# EAGLE design Sensor_Cheeta (EAGLE 9.6.2)
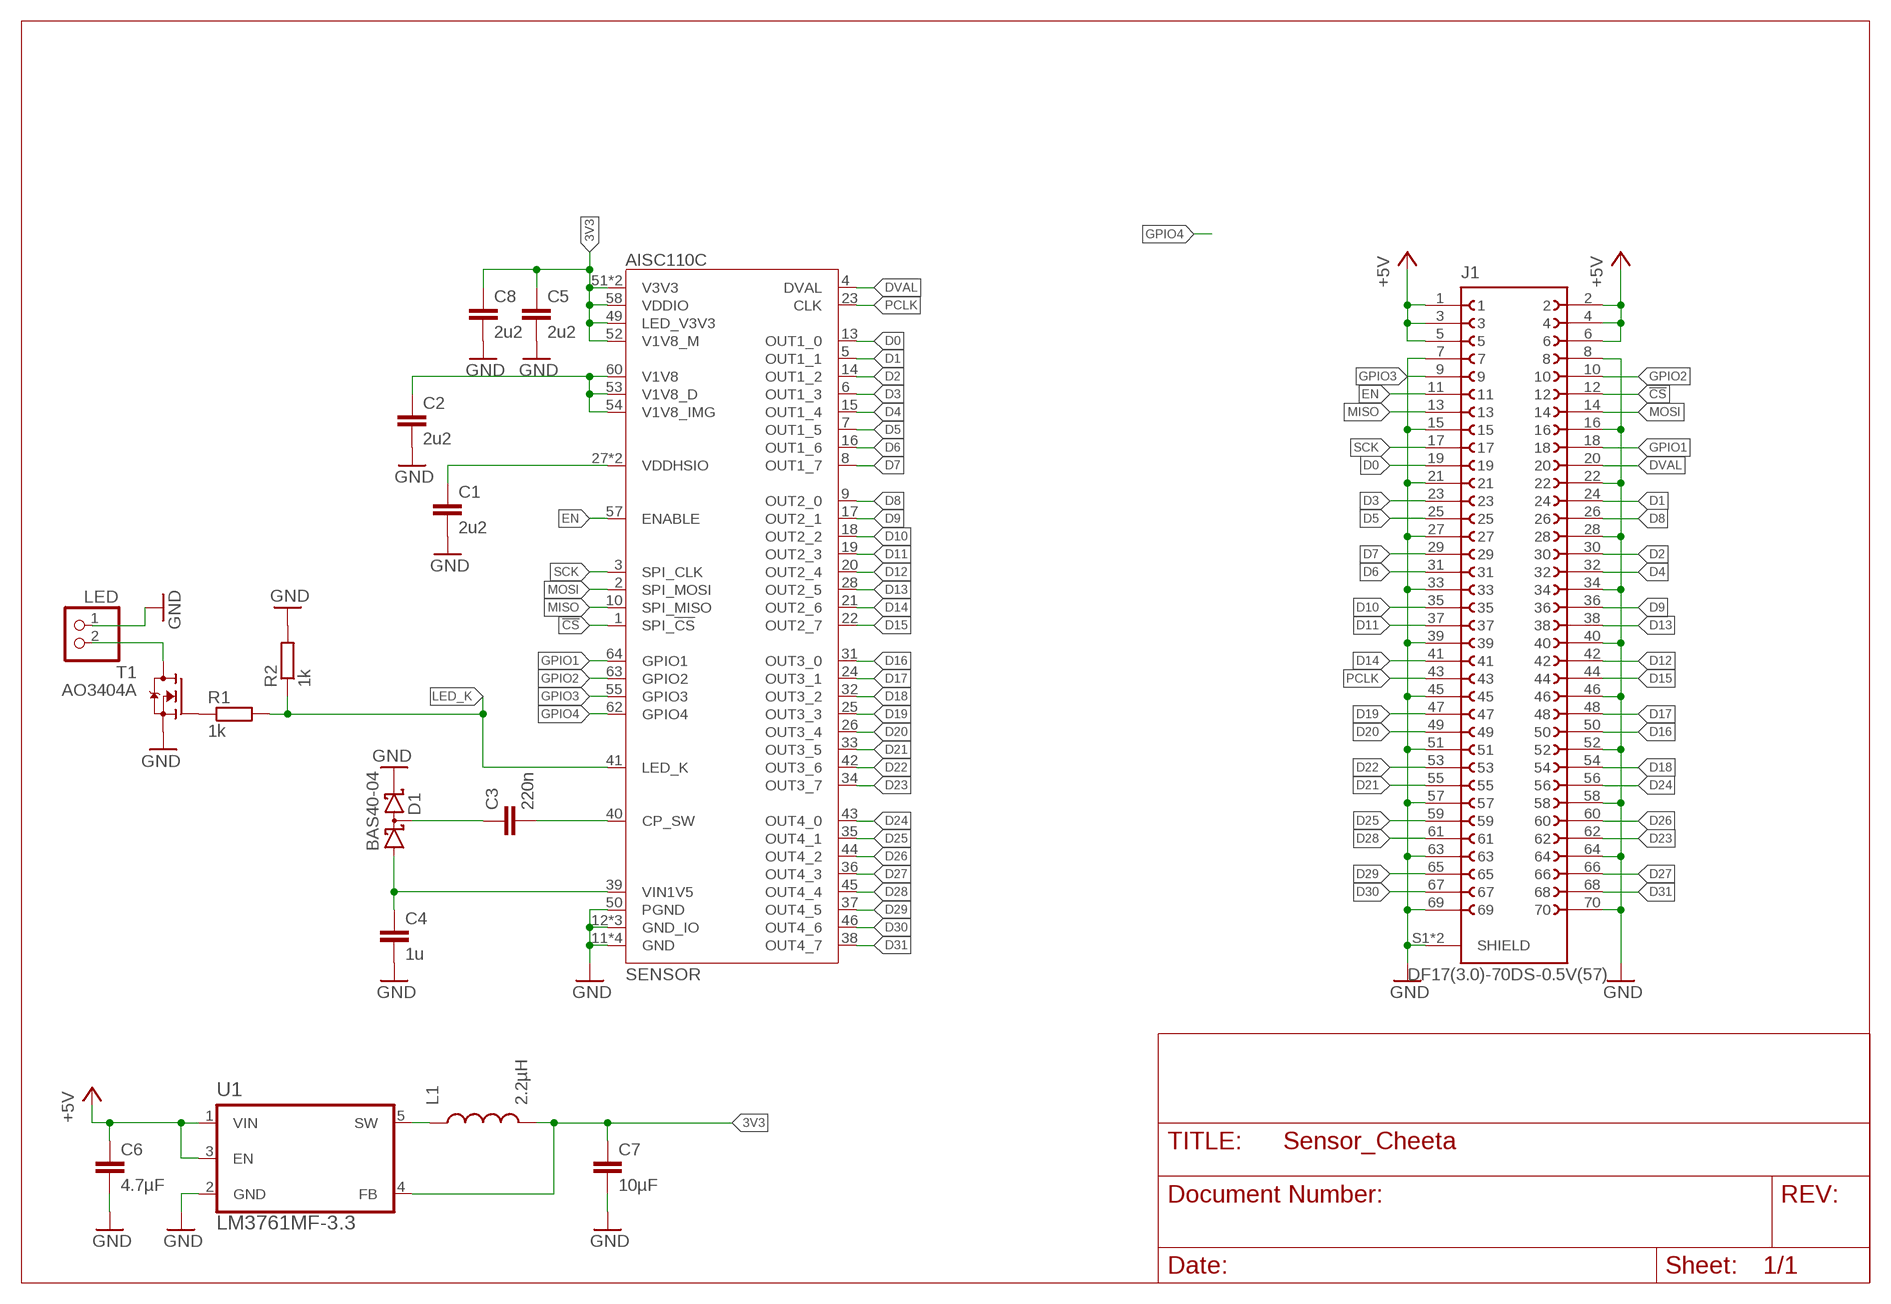
[diagram p0: schematic, sheet 1]

## Parts
C1  2u2  C-EUC0603  [C0603]
C2  2u2  C-EUC0603  [C0603]
C3  220n  C-EUC0603  [C0603]
C4  1u  C-EUC0603  [C0603]
C5  2u2  C-EUC0603  [C0603]
C6  4.7µF  C-EUC0603  [C0603]
C7  10µF  C-EUC0603  [C0603]
C8  2u2  C-EUC0603  [C0603]
D1  BAS40-04  [SOT23]
J1  DF17(3.0)-70DS-0.5V(57)  [DF17(3.0)-70DS-0.5V(57)]
L1  2.2µH  DO3314  [SO3314]
LED  PINHD-1X2  [1X02]
R1  1k  R-EU_R0603  [R0603]
R2  1k  R-EU_R0603  [R0603]
SENSOR  AISC110C  [64_LD_OLGA]
T1  AO3404A  N-MOSFET-SOT23-3  [SOT23]
U1  LM3761MF-3.3  LM3671  [SOT95P284X122-5N]

## Nets
3V3: C5.1 C7.1 C8.1 L1.2 SENSOR.49(LED_V3V3) SENSOR.51(V3V3) SENSOR.52(V1V8_M) SENSOR.58(VDDIO) SENSOR.59(V3V3) U1.4(FB)
!CS: J1.12 SENSOR.1(SPI_!CS)
+5V: C6.1 J1.1 J1.2 J1.3 J1.4 J1.5 J1.6 U1.1(VIN) U1.3(EN)
D0: J1.19 SENSOR.13(OUT1_0)
D1: J1.24 SENSOR.5(OUT1_1)
D2: J1.30 SENSOR.14(OUT1_2)
D3: J1.23 SENSOR.6(OUT1_3)
D4: J1.32 SENSOR.15(OUT1_4)
D5: J1.25 SENSOR.7(OUT1_5)
D6: J1.31 SENSOR.16(OUT1_6)
D7: J1.29 SENSOR.8(OUT1_7)
D8: J1.26 SENSOR.9(OUT2_0)
D9: J1.36 SENSOR.17(OUT2_1)
D10: J1.35 SENSOR.18(OUT2_2)
D11: J1.37 SENSOR.19(OUT2_3)
D12: J1.42 SENSOR.20(OUT2_4)
D13: J1.38 SENSOR.28(OUT2_5)
D14: J1.41 SENSOR.21(OUT2_6)
D15: J1.44 SENSOR.22(OUT2_7)
D16: J1.50 SENSOR.31(OUT3_0)
D17: J1.48 SENSOR.24(OUT3_1)
D18: J1.54 SENSOR.32(OUT3_2)
D19: J1.47 SENSOR.25(OUT3_3)
D20: J1.49 SENSOR.26(OUT3_4)
D21: J1.55 SENSOR.33(OUT3_5)
D22: J1.53 SENSOR.42(OUT3_6)
D23: J1.62 SENSOR.34(OUT3_7)
D24: J1.56 SENSOR.43(OUT4_0)
D25: J1.59 SENSOR.35(OUT4_1)
D26: J1.60 SENSOR.44(OUT4_2)
D27: J1.66 SENSOR.36(OUT4_3)
D28: J1.61 SENSOR.45(OUT4_4)
D29: J1.65 SENSOR.37(OUT4_5)
D30: J1.67 SENSOR.46(OUT4_6)
D31: J1.68 SENSOR.38(OUT4_7)
DVAL: J1.20 SENSOR.4(DVAL)
EN: J1.11 SENSOR.57(ENABLE)
GND: C1.2 C2.2 C4.2 C5.2 C6.2 C7.2 C8.2 D1.2(C2) J1.7 J1.8 J1.15 J1.16 J1.21 J1.22 J1.27 J1.28 J1.33 J1.34 J1.39 J1.40 J1.45 J1.46 J1.51 J1.52 J1.57 J1.58 J1.63 J1.64 J1.69 J1.70 J1.S1(SHIELD) J1.S2(SHIELD) LED.1 R2.2 SENSOR.11(GND) SENSOR.12(GND_IO) SENSOR.30(GND_IO) SENSOR.47(GND_IO) SENSOR.48(GND) SENSOR.50(PGND) SENSOR.56(GND) SENSOR.61(GND) T1.2(S) U1.2(GND)
GPIO1: J1.18 SENSOR.64(GPIO1)
GPIO2: J1.10 SENSOR.63(GPIO2)
GPIO3: J1.9 SENSOR.55(GPIO3)
GPIO4: SENSOR.62(GPIO4)
LED_K: R1.2 R2.1 SENSOR.41(LED_K)
MISO: J1.13 SENSOR.10(SPI_MISO)
MOSI: J1.14 SENSOR.2(SPI_MOSI)
N$00003: C3.2 SENSOR.40(CP_SW)
N$00004: C4.1 D1.1(A1) SENSOR.39(VIN1V5)
N$00005: C3.1 D1.3(C1A2)
N$00006: LED.2 T1.3(D)
N$00009: L1.1 U1.5(SW)
N$00011: C2.1 SENSOR.53(V1V8_D) SENSOR.54(V1V8_IMG) SENSOR.60(V1V8)
N$00013: C1.1 SENSOR.27(VDDHSIO) SENSOR.29(VDDHSIO)
N$29: R1.1 T1.1(G)
PCLK: J1.43 SENSOR.23(CLK)
SCK: J1.17 SENSOR.3(SPI_CLK)

## Library data of the parts
C1 C2 C4 C5 C8 = rcl:C-EU: CAPACITOR, European symbol; BUERKLIN: 53D1659; LAGERORT: 20/10; MBM: 10; PREIS: 0,10; SPICEPREFIX: C
C3 = rcl:C-EU: CAPACITOR, European symbol; BUERKLIN: 53D2071; MBM: 10; PREIS: 0,10; SPICEPREFIX: C
C6 = rcl:C-EU: CAPACITOR, European symbol; BUERKLIN: 53D1659; LAGERORT: 20/10; MBM: 10; PREIS: 0,10
C7 = rcl:C-EU: CAPACITOR, European symbol; BUERKLIN: 53D2088; MBM: 10; PREIS: 0,29
D1 = diode:BAS40-04: Silicon Schottky Diodes General-purpose diode for high-speed switching
J1 = Hirose:DF17(3.0)-70DS-0.5V(57)
L1 = inductor-coilcraft:DO3314: DO3314; FARNELL: 2457514; LAGERORT: 102/06; MBM: 1; PREIS: 1,70
LED = pinhead:PINHD-1X2: PIN HEADER
R1 R2 = rcl:R-EU_: RESISTOR, European symbol; LCSC: C11702; SPICEPREFIX: R
SENSOR = aistorm:AISC110C: AISC110C 80x120 Pixel Ultra High-Speed Imager
T1 = transistor-fet:N-MOSFET: N-MOSFET; LCSC: C30010
U1 = texas:LM3671: LM3671 2-MHz, 600-mA Step-Down DC-DC Converter Farnell Order Numbers: MF-3.3 : 1685767 MF-2.5 : 2492196 MF-1.8 : 1685654 MF-1.5 : 2492195 MF-ADJ: 1008256

## Board
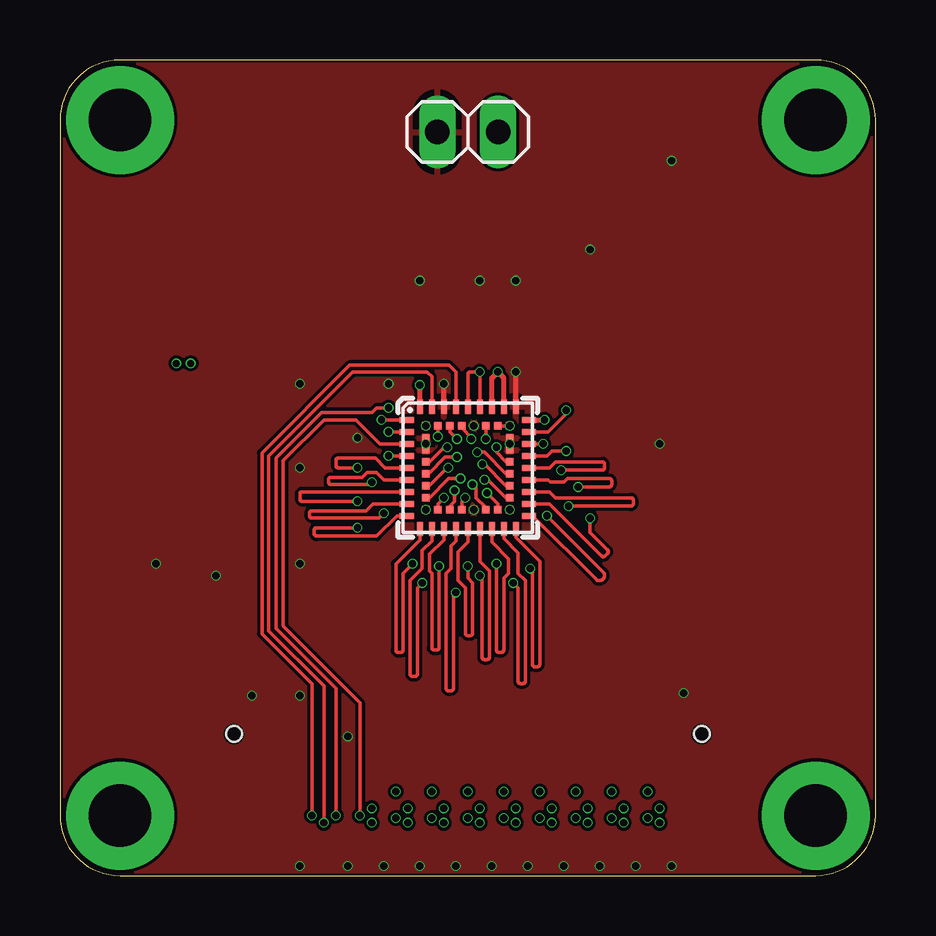
[diagram p1: board, top side]
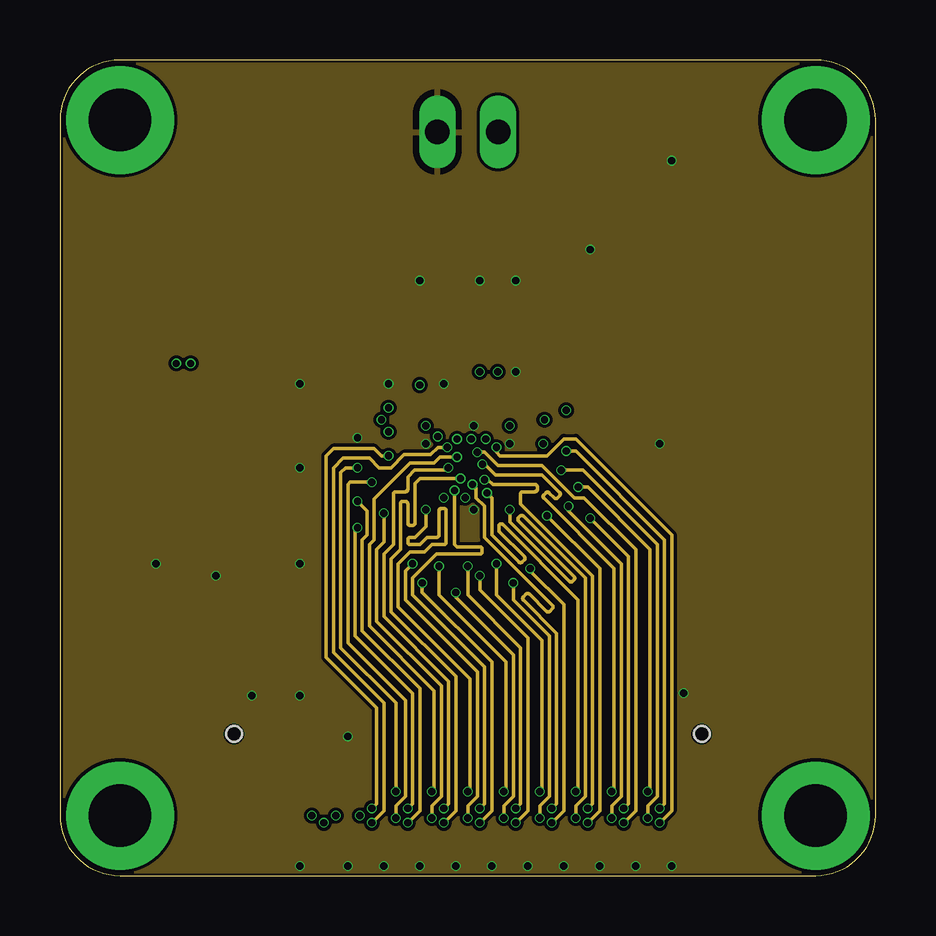
[diagram p2: board, inner layer Route2]
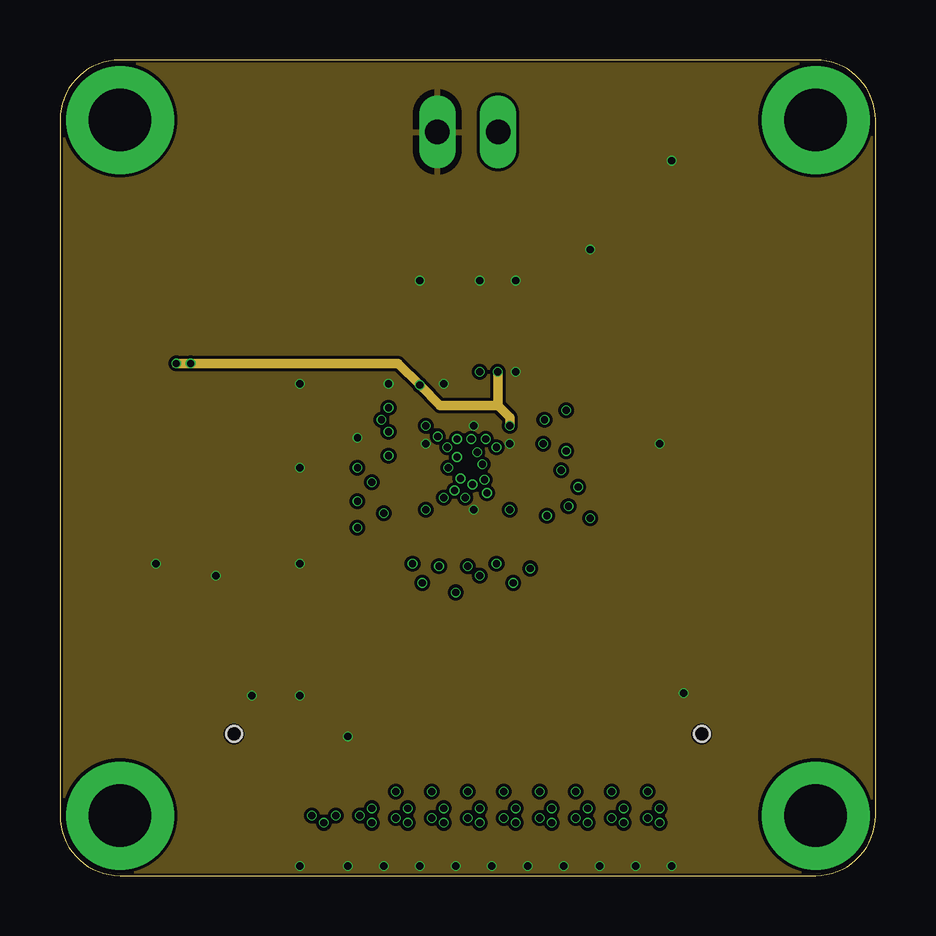
[diagram p3: board, inner layer Route15]
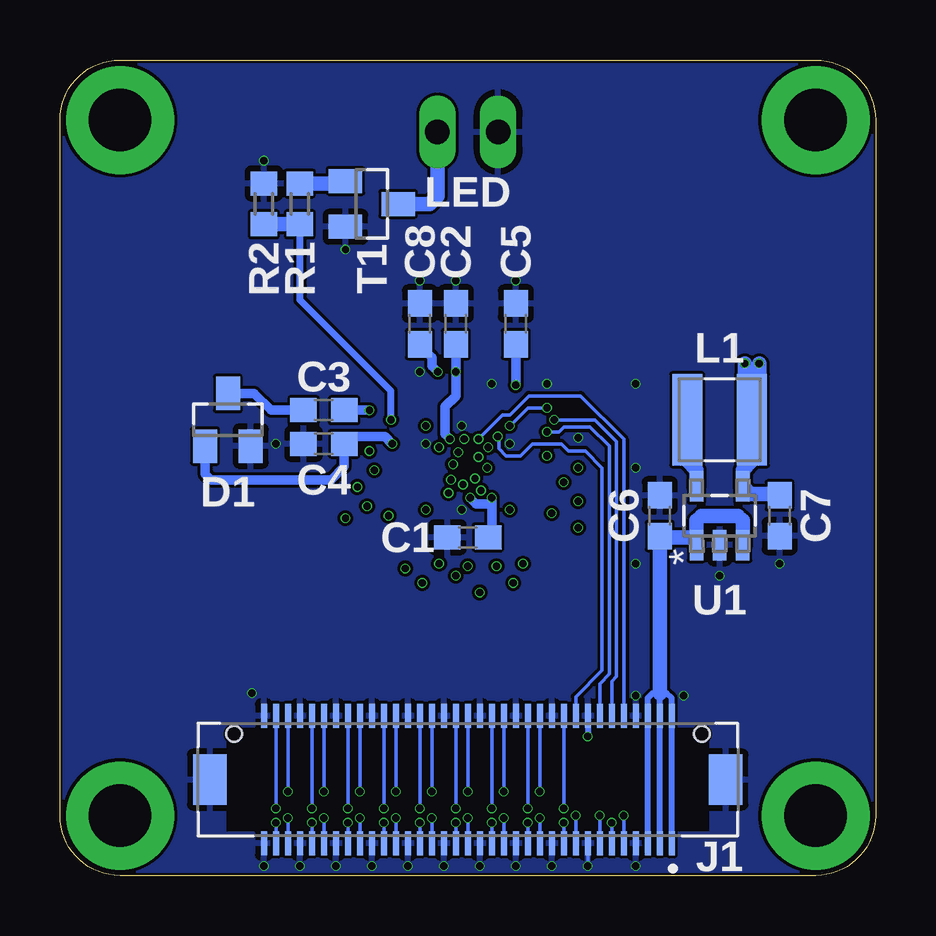
[diagram p4: board, bottom side, seen from below]

Size 34 x 34 mm. Coordinates in mm from the lower left corner, seen from the top.
Outline: 0,31.5 0,2.5 arc90 2.5,0 31.5,0 arc90 34,2.5 34,31.5 arc90 31.5,34 2.5,34 arc90 0,31.5
Copper layers (1*2*15*16): Top 0.035559375mm / dielectric 0.17018125mm / Route2 0.01778125mm / dielectric 47mil / Route15 0.01778125mm / dielectric 0.17018125mm / Bottom 0.035559375mm
Design rules "jlcpcb-4-layer *": minimum track width 5mil, minimum drill 0.2mm, track to track 5mil, track to pad 5mil, pad to pad 5mil, via to via 5mil, smd to smd 0mil, copper to edge 0.1mm, drill to drill 5mil, minimum pad ring 0.1mm, minimum via ring 0.05mm, stop-mask expansion 3mil, vias tented up to drill 100mil, thermal gap 10mil
tRestrict: 2 lines

### Footprints (pad centres in the part's own frame; a part is rotated, then mirrored left to right if it is on the bottom)
C0603 = smd 1.1 x 1: 1 -0.85,0; 2 0.85,0
SOT23 = smd 1 x 1.4: 1 -0.95,-1.1; 2 0.95,-1.1; 3 0,1.1
DF17(3.0)-70DS-0.5V(57) = smd 0.25 x 1: 1 -8.5,2.65; 2 -8.5,-2.65; 3 -8,2.65; 4 -8,-2.65; 5 -7.5,2.65; 6 -7.5,-2.65; 7 -7,2.65; 8 -7,-2.65; 9 -6.5,2.65; 10 -6.5,-2.65; 11 -6,2.65; 12 -6,-2.65; 13 -5.5,2.65; 14 -5.5,-2.65; 15 -5,2.65; 16 -5,-2.65; 17 -4.5,2.65; 18 -4.5,-2.65; 19 -4,2.65; 20 -4,-2.65; 21 -3.5,2.65; 22 -3.5,-2.65; 23 -3,2.65; 24 -3,-2.65; 25 -2.5,2.65; 26 -2.5,-2.65; 27 -2,2.65; 28 -2,-2.65; 29 -1.5,2.65; 30 -1.5,-2.65; 31 -1,2.65; 32 -1,-2.65; 33 -0.5,2.65; 34 -0.5,-2.65; 35 0,2.65; 36 0,-2.65; 37 0.5,2.65; 38 0.5,-2.65; 39 1,2.65; 40 1,-2.65; 41 1.5,2.65; 42 1.5,-2.65; 43 2,2.65; 44 2,-2.65; 45 2.5,2.65; 46 2.5,-2.65; 47 3,2.65; 48 3,-2.65; 49 3.5,2.65; 50 3.5,-2.65; 51 4,2.65; 52 4,-2.65; 53 4.5,2.65; 54 4.5,-2.65; 55 5,2.65; 56 5,-2.65; 57 5.5,2.65; 58 5.5,-2.65; 59 6,2.65; 60 6,-2.65; 61 6.5,2.65; 62 6.5,-2.65; 63 7,2.65; 64 7,-2.65; 65 7.5,2.65; 66 7.5,-2.65; 67 8,2.65; 68 8,-2.65; 69 8.5,2.65; 70 8.5,-2.65 | smd 1.4 x 2.1: S1 -10.75,0; S2 10.75,0 | hole 0.65: -9.75,-1.9; 9.75,-1.9
SO3314 = smd 1.25 x 3.8: 1 1.35,0; 2 -1.35,0
1X02 = drill 1.016 long: 1 -1.27,0; 2 1.27,0
R0603 = smd 1 x 1.1: 1 -0.85,0; 2 0.85,0
64_LD_OLGA = smd 0.6 x 0.25: 1 -2.55,2; 2 -2.55,1.5; 3 -2.55,1; 4 -2.55,0.5; 5 -2.55,0; 6 -2.55,-0.5; 7 -2.55,-1; 8 -2.55,-1.5; 9 -2.55,-2; 33 2.55,-2; 34 2.55,-1.5; 35 2.55,-1; 36 2.55,-0.5; 37 2.55,0; 38 2.55,0.5; 39 2.55,1; 40 2.55,1.5; 41 2.55,2 | smd 0.3 x 0.3: 10 -1.75,1.75; 11 -1.75,1.25; 12 -1.75,0.75; 13 -1.75,0.25; 14 -1.75,-0.25; 15 -1.75,-0.75; 16 -1.75,-1.25; 17 -1.75,-1.75; 27 -1.25,-1.75; 28 -0.75,-1.75; 29 -0.25,-1.75; 30 0.25,-1.75; 31 0.75,-1.75; 32 1.25,-1.75; 42 1.75,-1.75; 43 1.75,-1.25; 44 1.75,-0.75; 45 1.75,-0.25; 46 1.75,0.25; 47 1.75,0.75; 48 1.75,1.25; 49 1.75,1.75; 59 1.25,1.75; 60 0.75,1.75; 61 0.25,1.75; 62 -0.25,1.75; 63 -0.75,1.75; 64 -1.25,1.75 | smd 0.25 x 0.6: 18 -2,-2.55; 19 -1.5,-2.55; 20 -1,-2.55; 21 -0.5,-2.55; 22 0,-2.55; 23 0.5,-2.55; 24 1,-2.55; 25 1.5,-2.55; 26 2,-2.55; 50 2,2.55; 51 1.5,2.55; 52 1,2.55; 53 0.5,2.55; 54 0,2.55; 55 -0.5,2.55; 56 -1,2.55; 57 -1.5,2.55; 58 -2,2.55
SOT95P284X122-5N = smd 1.27 x 0.559: 1 -1.219,0.965; 2 -1.219,0; 3 -1.219,-0.965; 4 1.219,-0.965; 5 1.219,0.965

### Placement (x,y rotation side)
C1  17,14.1 180 bottom
C2  17.5,23 90 bottom
C3  23,19.4 0 bottom
C4  23,18 180 bottom
C5  15,23 90 bottom
C6  9,15 90 bottom
C7  4,15 270 bottom
C8  19,23 90 bottom
D1  27,19 0 bottom
J1  17,4 180 bottom
L1  6.5,19 180 bottom
LED  17,31 0 top
R1  24,28 270 bottom
R2  25.5,28 90 bottom
SENSOR  17,17 0 top
T1  21,28 270 bottom
U1  6.5,15 90 bottom

### Tracks (layer width: path | path; a pad name or v marks a point on that pad's centre or on a via)
3V3  (via drill 0.3)
  Top 0.152: SENSOR.49 SENSOR.59
  Top 0.2: SENSOR.51 18.5,20.75 v18.25,21 18,20.75 SENSOR.52 | SENSOR.58 v15,20.45
  Route15 0.4: 18.25,19.6 15.85,19.6 v15,20.45 14.1,21.35 v5.45,21.35 v4.85,21.35 | 18.25,19.6 v18.25,21 | 18.25,19.6 18.75,19.1 SENSOR.49
  Bottom 0.4: v15,20.45 C5.1 | v18.25,21 18.5,21.25 18.5,21.6 19,22.1 C8.1
  Bottom 0.6: L1.2 5.15,17.3 5.54,16.91 U1.4 5.22,15.9 4.05,15.9 C7.1 | L1.2 4.85,19.3 v4.85,21.35 | L1.2 5.45,19.3 v5.45,21.35
  other vias: 18.75,18.75
!CS  (via drill 0.3)
  Top 0.152: SENSOR.1 v13.4,19
  Bottom 0.152: v13.4,19 11.7,19 10.8,18.1 10.8,8.3 11,8.1 J1.12
+5V
  Bottom 0.25: J1.1 J1.2 8.5,7.4 8.7,7.6 9,7.6 | J1.3 J1.4 9,7.6 | J1.5 J1.6 9.5,7.4 9.3,7.6 9,7.6
  Bottom 0.6: U1.1 7.46,14.1 | 7.46,14.1 7.46,14.8 7.27,15 5.73,15 5.54,14.8 U1.3 | 8.95,14.1 9,14.05 9,7.6 | C6.1 8.95,14.1 | 8.95,14.1 7.46,14.1
D0  (via drill 0.3)
  Top 0.152: v16.15,17.85 16,17.85 15.4,17.25 SENSOR.13
  Route2 0.152: v16.15,17.85 15.75,17.85 15.45,17.55 14.35,17.55 13.8,17 13.3,17 12.9,17.4 11.8,17.4 11.4,17 11.4,9.3 13.5,7.2 13.5,2.7 v13,2.2
  Bottom 0.152: v13,2.2 J1.19
D1  (via drill 0.3)
  Top 0.152: SENSOR.5 13.55,17 13.15,17.4 11.6,17.4 arc90 11.5,17.3 11.5,17.1 arc90 11.6,17 v12.4,17
  Route2 0.152: v12.4,17 11.9,17 11.7,16.8 11.7,9.5 14,7.2 v14,3.5
  Bottom 0.152: v14,3.5 J1.24
D2  (via drill 0.3)
  Top 0.152: SENSOR.14 15.36,16.75 16.05,17.45 v16.55,17.45
  Route2 0.152: v15.5,3.5 15.6,3.6 15.6,7.7 12.9,10.4 12.9,13.8 13.1,14 13.1,15.7 14.6,17.2 15.6,17.2 15.85,17.45 v16.55,17.45
  Bottom 0.152: v15.5,3.5 J1.30
D3  (via drill 0.3)
  Top 0.152: SENSOR.6 13.5,16.5 13.2,16.8 12.8,16.8 12.6,16.6 11.3,16.6 arc90 11.2,16.5 11.2,16.4 arc90 11.3,16.3 12.9,16.3 v13,16.4
  Route2 0.152: v13,16.4 12.1,16.4 12,16.3 12,9.7 14.4,7.3 14.4,3.3 14,2.9 v14,2.4
  Bottom 0.152: v14,2.4 J1.23
D4  (via drill 0.3)
  Top 0.152: SENSOR.15 15.39,16.25 16.14,17 v16.19,17
  Route2 0.152: v16.19,17 16.09,16.9 14.79,16.9 14.5,16.61 14.5,16.1 arc-90 14.4,16 14,16 arc90 13.9,15.9 13.9,13.8 13.5,13.4 13.5,10.8 16.2,8.1 16.2,3 v16,2.8
  Bottom 0.152: v16,2.8 J1.32
D5  (via drill 0.3)
  Top 0.152: SENSOR.7 10.1,16 arc90 10,15.9 10,15.7 arc90 10.1,15.6 v12.4,15.6
  Route2 0.152: v14.5,2.2 15,2.7 15,7.8 12.6,10.2 12.6,14 12.8,14.2 12.8,15.2 v12.4,15.6
  Bottom 0.152: v14.5,2.2 J1.25
D6  (via drill 0.3)
  Top 0.152: SENSOR.16 15.4,15.75 16.2,16.55 v16.7,16.55
  Route2 0.152: v16,2.2 16.5,2.7 16.5,8.3 13.8,11 13.8,13.2 14.2,13.6 14.2,15.5 arc-90 14.3,15.6 14.4,15.6 arc-90 14.5,15.5 14.5,14.7 arc90 14.6,14.6 14.7,14.6 arc90 14.8,14.7 14.8,16.35 15,16.55 v16.7,16.55
  Bottom 0.152: v16,2.2 J1.31
D7  (via drill 0.3)
  Top 0.152: SENSOR.8 13.05,15.5 12.75,15.2 10.5,15.2 arc90 10.4,15.1 10.4,15 arc90 10.5,14.9 13.3,14.9 v13.5,15.1
  Route2 0.152: v13.5,15.1 13.5,13.9 13.2,13.6 13.2,10.6 15.9,7.9 15.9,3.3 15.5,2.9 v15.5,2.4
  Bottom 0.152: v15.5,2.4 J1.29
D8  (via drill 0.3)
  Top 0.152: SENSOR.9 14.05,15 13.2,14.15 10.7,14.15 arc-90 10.6,14.25 10.6,14.4 arc-90 10.7,14.5 v12.4,14.5
  Route2 0.152: v12.4,14.5 12.3,14.4 12.3,10 14.7,7.6 14.7,3 v14.5,2.8
  Bottom 0.152: v14.5,2.8 J1.26
D9  (via drill 0.3)
  Route2 0.152: v17,3.5 17.1,3.6 17.1,8.2 14.1,11.2 14.1,13 14.6,13.5 15.2,13.5 15.5,13.8 16,13.8 arc90 16.1,13.9 16.1,15.2 arc90 16,15.3 15.9,15.3 arc90 15.8,15.2 15.8,14.2 arc-90 15.7,14.1 15.3,14.1 15,13.8 14.6,13.8 arc-90 14.5,13.9 14.5,14 arc-90 14.6,14.1 14.8,14.1 15.25,14.55 SENSOR.17
  Bottom 0.152: v17,3.5 J1.36
  other vias: 15.25,15.25
D10  (via drill 0.3)
  Top 0.152: SENSOR.18 15,14 14,13 14,9.4 arc90 14.1,9.3 14.2,9.3 arc90 14.3,9.4 14.3,12.6 v14.7,13
  Route2 0.152: v14.7,13 14.4,12.7 14.4,11.5 17.4,8.5 17.4,3.3 17,2.9 v17,2.4
  Bottom 0.152: v17,2.4 J1.35
D11  (via drill 0.3)
  Top 0.152: SENSOR.19 15.5,13.95 15.1,13.55 15.1,12.8 14.6,12.3 14.6,8.4 arc90 14.7,8.3 14.8,8.3 arc90 14.9,8.4 14.9,12 v15.1,12.2
  Route2 0.152: v17.5,2.2 18,2.7 18,8.9 15.1,11.8 v15.1,12.2
  Bottom 0.152: v17.5,2.2 J1.37
D12  (via drill 0.3)
  Top 0.152: SENSOR.20 16,14 15.4,13.4 15.4,12.7 15.5,12.6 15.5,9.5 arc90 15.6,9.4 15.7,9.4 arc90 15.8,9.5 v15.8,12.9
  Route2 0.152: v18.5,3.5 18.6,3.6 18.6,8.9 15.8,11.7 v15.8,12.9
  Bottom 0.152: v18.5,3.5 J1.42
D13  (via drill 0.3)
  Top 0.152: v16.45,16.05 16.45,15.6 16.25,15.4 SENSOR.28
  Route2 0.152: v17.5,2.8 17.7,3 17.7,8.7 14.7,11.7 14.7,12.4 15.7,13.4 17.5,13.4 arc90 17.6,13.5 17.6,13.6 arc90 17.5,13.7 16.55,13.7 16.45,13.8 v16.45,16.05
  Bottom 0.152: v17.5,2.8 J1.38
D14  (via drill 0.3)
  Top 0.152: SENSOR.21 16.5,13.95 16.3,13.75 16.3,12.8 16.1,12.6 16.1,7.8 arc90 16.2,7.7 16.3,7.7 arc90 16.4,7.8 16.4,11.7 v16.5,11.8
  Route2 0.152: v16.5,11.8 16.5,11.6 18.9,9.2 18.9,3.3 18.5,2.9 v18.5,2.4
  Bottom 0.152: v18.5,2.4 J1.41
D15  (via drill 0.3)
  Top 0.152: SENSOR.22 17,13.9 16.6,13.5 16.6,12.3 16.9,12 16.9,10.1 arc90 17,10 17.1,10 arc90 17.2,10.1 17.2,12.2 17,12.4 v17,12.9
  Route2 0.152: v17,12.9 17,11.7 19.2,9.5 19.2,3 v19,2.8
  Bottom 0.152: J1.44 v19,2.8
D16  (via drill 0.3)
  Top 0.152: v17.2,16.3 17.35,16.15 17.35,15.75 17.75,15.35 SENSOR.31
  Route2 0.152: v17.2,16.3 17.35,16.15 17.35,15.75 17.7,15.4 17.7,14.1 20.53,11.27 arc-90 20.53,11.13 20.42,11.02 arc-90 20.28,11.02 19.57,11.73 arc90 19.43,11.73 19.32,11.62 arc90 19.32,11.48 20.7,10.1 20.7,3 v20.5,2.8
  Bottom 0.152: J1.50 v20.5,2.8
D17  (via drill 0.3)
  Top 0.152: SENSOR.24 18,13.9 18.7,13.2 18.7,12.6 18.5,12.4 18.5,9.4 arc-90 18.4,9.3 18.3,9.3 arc-90 18.2,9.4 v18.2,13
  Route2 0.152: v18.2,13 18.2,11.7 20.1,9.8 20.1,3.6 v20,3.5
  Bottom 0.152: v20,3.5 J1.48
D18  (via drill 0.3)
  Top 0.152: SENSOR.32 18.25,15.5 v17.8,15.95
  Route2 0.152: v21.5,3.5 21.6,3.6 21.6,11.5 18.47,14.63 arc135 18.3,14.56 18.3,14.39 arc45 18.33,14.32 19.35,13.3 arc-90 19.35,13.15 19.27,13.07 arc-90 19.13,13.07 18,14.2 18,15.75 v17.8,15.95
  Bottom 0.152: J1.54 v21.5,3.5
D19  (via drill 0.3)
  Top 0.152: SENSOR.25 18.5,14.05 19.1,13.45 19.1,12.6 19.4,12.3 19.4,8.1 arc-90 19.3,8 19.2,8 arc-90 19.1,8.1 19.1,12 v18.9,12.2
  Route2 0.152: v18.9,12.2 18.9,11.5 20.4,10 20.4,3.3 20,2.9 v20,2.4
  Bottom 0.152: v20,2.4 J1.47
D20  (via drill 0.3)
  Top 0.152: SENSOR.26 19,14.1 20,13.1 20,8.8 arc-90 19.9,8.7 19.8,8.7 arc-90 19.7,8.8 19.7,12.7 v19.6,12.8
  Route2 0.152: v20.5,2.2 21,2.7 21,11.3 19.6,12.7 v19.6,12.8
  Bottom 0.152: v20.5,2.2 J1.49
D21  (via drill 0.3)
  Top 0.152: v20.3,15 22.64,12.66 arc-45 22.7,12.52 22.7,12.5 arc-90 22.5,12.3 22.43,12.3 arc-45 22.38,12.32 19.7,15 SENSOR.33
  Route2 0.152: v20.3,15 22.5,12.8 22.5,2.7 v22,2.2
  Bottom 0.152: J1.55 v22,2.2
D22  (via drill 0.3)
  Route2 0.152: v21.5,2.4 21.5,2.9 21.9,3.3 21.9,12.4 19.32,14.98 arc90 19.18,14.98 19.12,14.92 arc90 19.12,14.78 21.43,12.47 arc-90 21.43,12.33 21.37,12.27 arc-90 21.23,12.27 18.75,14.75 SENSOR.42
  Bottom 0.152: J1.53 v21.5,2.4
  other vias: 18.75,15.25
D23  (via drill 0.3)
  Top 0.152: SENSOR.34 20.4,15.5 22.58,13.32 arc90 22.72,13.32 22.83,13.43 arc90 22.83,13.57 22.1,14.3 v22.1,14.9
  Route2 0.152: v22.1,14.9 23.7,13.3 23.7,3 v23.5,2.8
  Bottom 0.152: v23.5,2.8 J1.62
D24  (via drill 0.3)
  Top 0.152: SENSOR.43 18.6,15.75 17.85,16.5 v17.7,16.5
  Route2 0.152: v17.7,16.5 17.85,16.5 18.05,16.3 19.8,16.3 arc-90 19.9,16.2 19.9,16.1 arc-90 19.8,16 19.3,16 arc90 19.2,15.9 19.2,15.5 22.2,12.5 22.2,3 v22,2.8
  Bottom 0.152: J1.56 v22,2.8
D25  (via drill 0.3)
  Top 0.152: SENSOR.35 20.4,16 20.65,15.75 23.8,15.75 arc-90 23.9,15.65 23.9,15.5 arc-90 23.8,15.4 v21.2,15.4
  Route2 0.152: v21.2,15.4 21.2,15.2 23.4,13 23.4,3.3 23,2.9 v23,2.4
  Bottom 0.152: J1.59 v23,2.4
D26  (via drill 0.3)
  Top 0.152: SENSOR.44 18.6,16.25 17.7,17.15 v17.61,17.15
  Route2 0.152: v17.61,17.15 17.7,17.15 18.15,16.7 20.1,16.7 20.83,15.97 arc-90 20.83,15.83 20.75,15.75 arc-90 20.6,15.75 20.4,15.95 arc90 20.25,15.95 20.17,15.87 arc90 20.17,15.73 23.1,12.8 23.1,3.6 v23,3.5
  Bottom 0.152: v23,3.5 J1.60
D27  (via drill 0.3)
  Top 0.152: SENSOR.36 20.35,16.5 20.45,16.4 21,16.4 21.15,16.55 22.9,16.55 arc-90 23,16.45 23,16.3 arc-90 22.9,16.2 v21.6,16.2
  Route2 0.152: v21.6,16.2 22,16.2 24.6,13.6 24.6,3.6 v24.5,3.5
  Bottom 0.152: v24.5,3.5 J1.66
D28  (via drill 0.3)
  Top 0.152: SENSOR.45 18.6,16.75 17.7,17.65 v17.4,17.65
  Route2 0.152: v17.4,17.65 17.7,17.65 18.25,17.1 20.1,17.1 21.45,15.75 21.85,15.75 24,13.6 24,2.7 v23.5,2.2
  Bottom 0.152: J1.61 v23.5,2.2
D29  (via drill 0.3)
  Top 0.152: SENSOR.37 20.4,17 20.65,17.25 22.6,17.25 arc-90 22.7,17.15 22.7,17 arc-90 22.6,16.9 v20.9,16.9
  Route2 0.152: v20.9,16.9 21.8,16.9 24.9,13.8 24.9,3.3 24.5,2.9 v24.5,2.4
  Bottom 0.152: J1.65 v24.5,2.4
D30  (via drill 0.3)
  Top 0.152: SENSOR.46 18.6,17.25 18.2,17.65 v18.2,17.85
  Route2 0.152: v18.2,17.85 18.2,17.65 18.35,17.5 20.3,17.5 21,18.2 21.5,18.2 25.5,14.2 25.5,2.7 v25,2.2
  Bottom 0.152: J1.67 v25,2.2
D31  (via drill 0.3)
  Top 0.152: v21.1,17.7 20.5,17.7 20.3,17.5 SENSOR.38
  Route2 0.152: v21.1,17.7 21.5,17.7 25.2,14 25.2,3 v25,2.8
  Bottom 0.152: v25,2.8 J1.68
DVAL  (via drill 0.3)
  Top 0.152: SENSOR.4 v13.7,17.5
  Route2 0.152: v13.7,17.5 13.4,17.5 13.1,17.8 11.4,17.8 11.1,17.5 11.1,9.1 13.2,7 13.2,3 v13,2.8
  Bottom 0.152: J1.20 v13,2.8
EN  (via drill 0.3)
  Top 0.152: SENSOR.57 15.5,20.8 15.3,21 12.2,21 8.7,17.5 8.7,10.2 11,7.9 v11,2.2
  Bottom 0.152: v11,2.2 J1.11
GND  (via drill 0.3)
  Top 0.152: SENSOR.47 18.7,17.75 18.75,17.8 v18.75,18 SENSOR.48 | SENSOR.11 SENSOR.12
  Top 0.2: SENSOR.56 v16,20.5 | SENSOR.50 v19,21
  Bottom 0.152: J1.15 v12,0.4
  Bottom 0.25: J1.16 v12,5.8
  other vias: 15.25,18 13.5,0.4 15,0.4 16.5,0.4 18,0.4 19.5,0.4 21,0.4 22.5,0.4 24,0.4 25.5,0.4 10,0.4 8,7.5 10,7.5 25,18 17.5,24.8 15,24.8 17.25,18.75 17.25,15.25 13.7,20.5 10,17 10,13 4,13 6.5,12.5 10,20.5 12.4,18.25 19,24.8 25.5,29.8 22.1,26.1 26,7.6
  pour Top: 0,0 34,0 34,34 0,34
  pour Bottom: 0,0 34,0 34,34 0,34
  pour Route15: 0,0 34,0 34,34 0,34
  pour Route2: 0,0 34,0 34,34 0,34
GPIO1  (via drill 0.3)
  Top 0.152: SENSOR.64 v15.75,18.3
  Bottom 0.152: v15.75,18.3 15.7,18.25 15.7,17.8 15.4,17.5 14.8,17.5 14.3,18 13.1,18 12.8,17.7 12.1,17.7 11.4,17 11.4,8.55 12.5,7.45 J1.18
GPIO2  (via drill 0.3)
  Top 0.152: SENSOR.63 16.25,18.5 v16.55,18.2
  Bottom 0.152: v16.55,18.2 15.55,19.2 15.25,19.2 14.45,20 12.3,20 10.5,18.2 J1.10
GPIO3  (via drill 0.3)
  Top 0.152: SENSOR.55 16.5,21 16.22,21.28 12.08,21.28 8.42,17.62 8.42,10.08 10.5,8 v10.5,2.5
  Bottom 0.152: v10.5,2.5 J1.9
GPIO4  (via drill 0.3)
  Top 0.152: SENSOR.62 16.75,18.65 17.15,18.25 v17.15,18.2
LED_K  (via drill 0.3)
  Top 0.2: SENSOR.41 v20.2,19
  Bottom 0.3: v20.2,19 20.2,20.2 24,24 R1.2
  Bottom 0.6: R1.2 R2.1
MISO  (via drill 0.3)
  Top 0.152: v13.7,19.5 13.2,19.5 13,19.3 10.9,19.3 9,17.4 9,10.3 11.5,7.8 v11.5,2.5
  Bottom 0.152: SENSOR.10 14.5,19.5 v13.7,19.5 | v11.5,2.5 J1.13
  other vias: 15.25,18.75
MOSI  (via drill 0.3)
  Top 0.152: SENSOR.2 v13.7,18.5
  Bottom 0.152: v13.7,18.5 13.2,18.5 13,18.7 11.9,18.7 11.1,17.9 11.1,8.4 11.5,8 J1.14
N$00001  (via drill 2.6 pad 4.5)
  other vias: 31.5,31.5
N$00002  (via drill 2.6 pad 4.5)
  other vias: 2.5,31.5
N$00003  (via drill 0.3)
  Top 0.152: SENSOR.40 20.35,18.5 21.1,19.25 v21.1,19.4
  Bottom 0.4: v21.1,19.4 C3.2
N$00004  (via drill 0.3)
  Top 0.152: SENSOR.39 v20.15,18
  Bottom 0.4: v20.15,18 20.45,18.3 21.85,18.3 C4.1 22.15,17.05 22.7,16.5 27.7,16.5 27.95,16.75 D1.1
N$00005
  Bottom 0.4: C3.1 25.2,19.4 25.9,20.1 D1.3
N$00006
  Bottom 0.6: T1.3 18.6,28 18.27,28.33 LED.2
N$00007  (via drill 2.6 pad 4.5)
  other vias: 2.5,2.5
N$00008  (via drill 2.6 pad 4.5)
  other vias: 31.5,2.5
N$00009
  Bottom 0.6: U1.5 7.46,16.91 7.85,17.3 L1.1
N$00011  (via drill 0.3)
  Top 0.152: SENSOR.60 v17.75,18.2 | SENSOR.53 v17.5,21 17.05,21 17,20.95 SENSOR.54
  Bottom 0.4: v17.75,18.2 17.95,18.4 17.95,19.55 17.5,20 v17.5,21 C2.1
N$00013  (via drill 0.3)
  Top 0.152: SENSOR.27 15.75,15.5 v16,15.75 | SENSOR.29 16.75,15.6 v16.9,15.75
  Bottom 0.4: C1.1 16,14.25 16,15.5 | 16,15.5 v16,15.75 | v16.9,15.75 16.65,15.5 16,15.5
N$29
  Bottom 0.6: R1.1 22.2,28.85 T1.1
PCLK  (via drill 0.3)
  Top 0.152: SENSOR.23 17.5,13.1 17.9,12.7 17.9,9.1 arc-90 17.8,9 17.7,9 arc-90 17.6,9.1 17.6,12.4 v17.5,12.5
  Route2 0.152: v17.5,12.5 17.5,11.9 19.5,9.9 19.5,2.7 v19,2.2
  Bottom 0.152: v19,2.2 J1.43
SCK  (via drill 0.3)
  Top 0.152: v12.5,2.5 12.5,7.2 9.3,10.4 9.3,17.3 11,19 12.35,19 13.35,18 SENSOR.3
  Bottom 0.152: v12.5,2.5 J1.17

### Text on the board
tStop: AISC110C